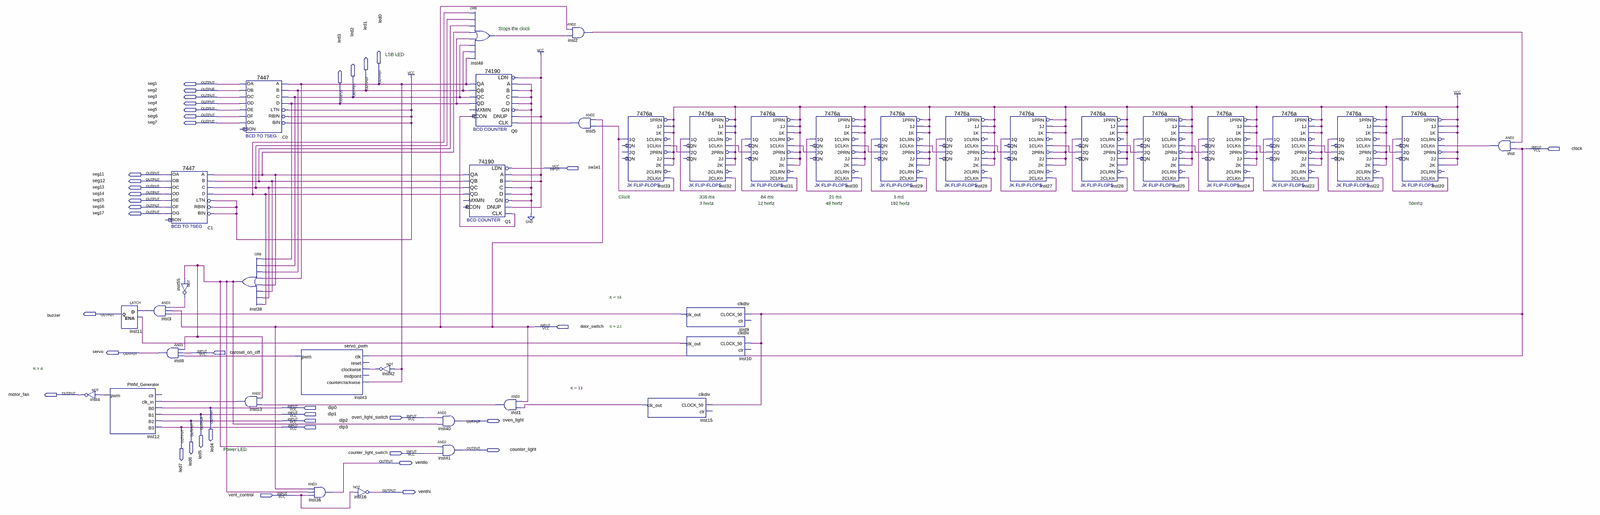
[diagram p0: schematic sheet, whole]
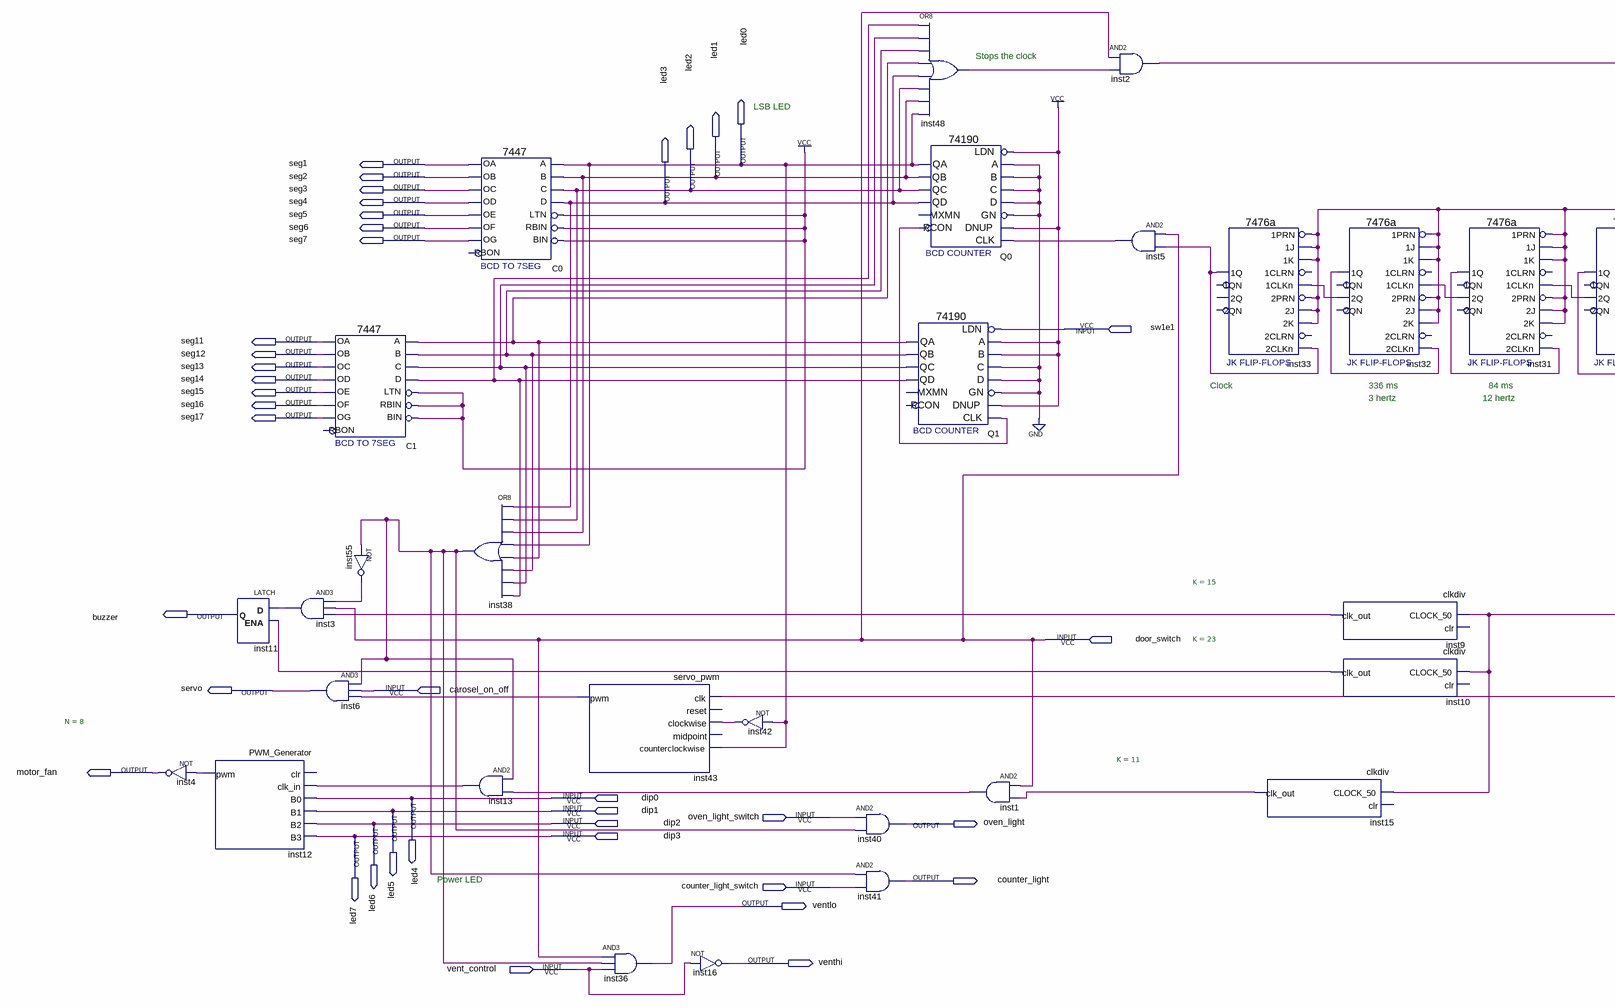
[diagram p1: schematic sheet, left part]
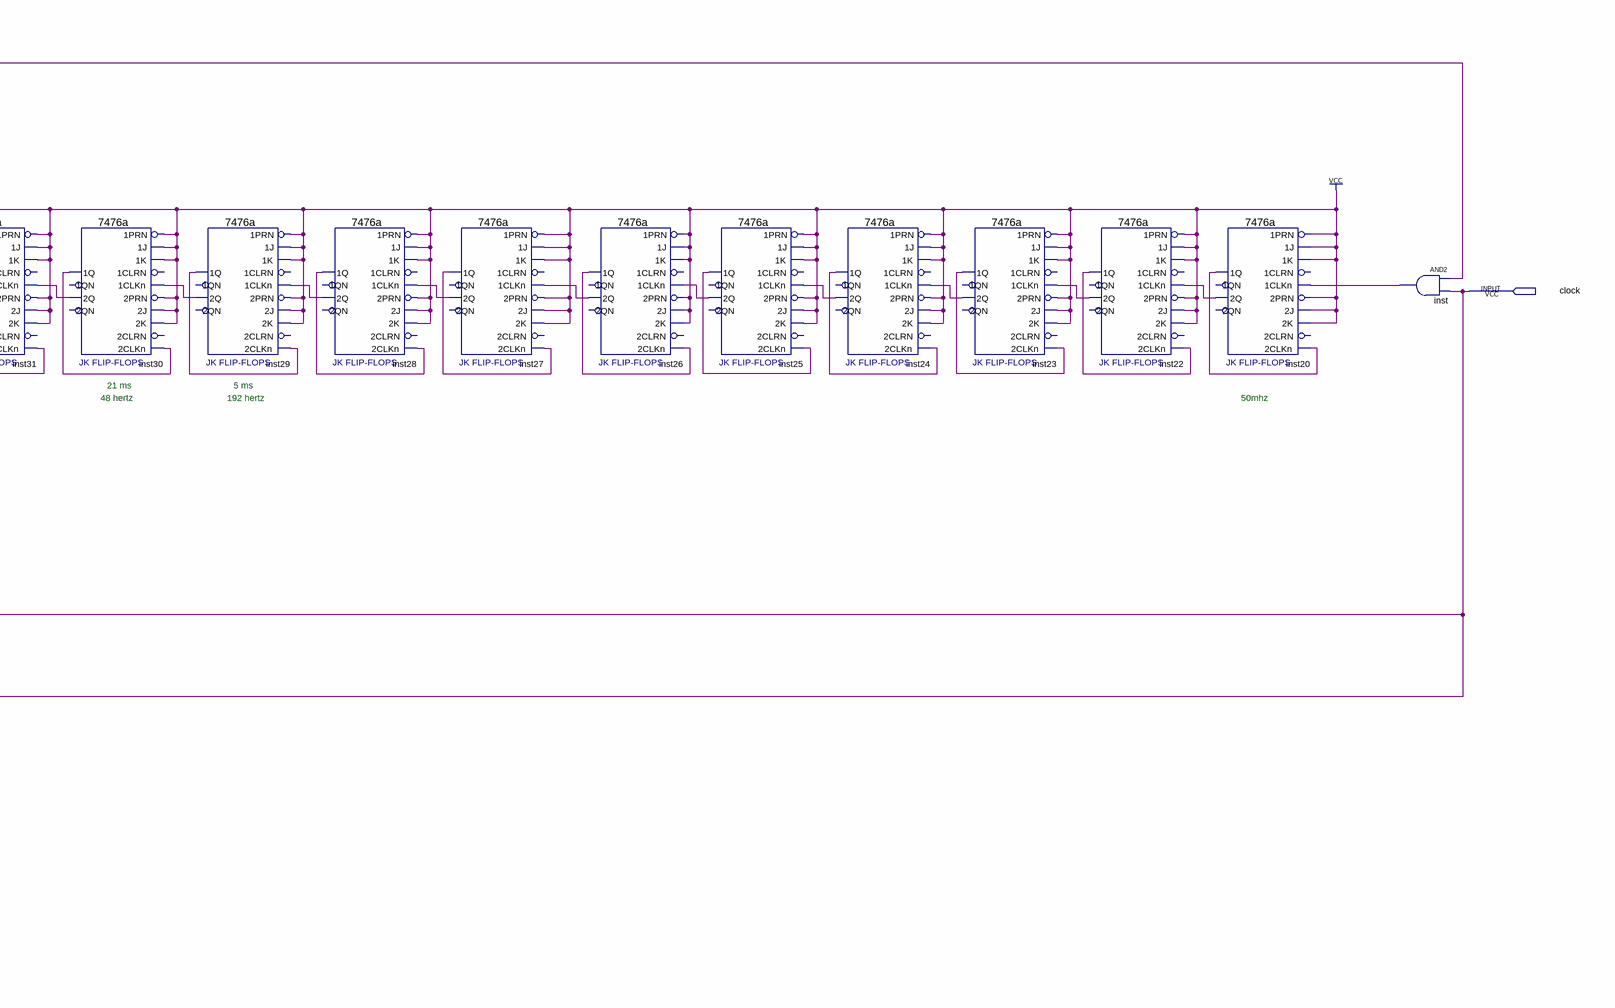
[diagram p2: schematic sheet, right part]
// Quartus schematic lidl.bdf as structural Verilog: 39 symbols, 40 pins
module lidl (
  input  clock,
  input  sw1e1,
  input  door_switch,
  input  carosel_on_off,
  input  dip0,
  input  dip1,
  input  oven_light_switch,
  input  dip2,
  input  dip3,
  input  counter_light_switch,
  input  vent_control,
  output seg1,
  output led0,
  output seg2,
  output led1,
  output seg3,
  output led2,
  output seg4,
  output led3,
  output seg5,
  output seg6,
  output seg7,
  output seg11,
  output seg12,
  output seg13,
  output seg14,
  output seg15,
  output seg16,
  output seg17,
  output buzzer,
  output servo,
  output motor_fan,
  output led4,
  output led5,
  output led6,
  output oven_light,
  output led7,
  output counter_light,
  output ventlo,
  output venthi
);

  wire inst1_out, inst2_out, inst3_out, inst5_out, inst9_clk_out, inst10_clk_out, inst12_pwm, inst13_out,
       inst15_clk_out, inst20_1q, inst20_2q, inst22_1q, inst22_2q, inst23_1q, inst23_2q, inst24_1q,
       inst24_2q, inst25_1q, inst25_2q, inst26_1q, inst26_2q, inst27_1q, inst27_2q, inst28_1q, inst28_2q,
       inst29_1q, inst29_2q, inst30_1q, inst30_2q, inst31_1q, inst31_2q, inst32_1q, inst32_2q, inst33_1q,
       inst38_out, inst42_out, inst43_pwm, inst48_out, inst55_out, inst_out, Q0_rcon, Q1_qa, Q1_qb, Q1_qc,
       Q1_qd;

  not inst4 (motor_fan, inst12_pwm);
  PWM_Generator #(.N(8)) inst12 (
    .clk_in(inst13_out), .B0(dip0), .B1(dip1), .B2(dip2), .B3(dip3), .pwm(inst12_pwm));  // open: clr
  LATCH inst11 (.D(inst3_out), .ENA(inst10_clk_out), .Q(buzzer));
  and inst3 (inst3_out, inst55_out, door_switch, inst9_clk_out);
  and inst6 (servo, inst38_out, carosel_on_off, inst43_pwm);
  \7447  C1 (
    .LTN(1'b1), .B(Q1_qb), .C(Q1_qc), .D(Q1_qd), .RBIN(1'b1), .BIN(1'b1), .A(Q1_qa), .OB(seg12), .OC(seg13),
    .OE(seg15), .OD(seg14), .OF(seg16), .OG(seg17), .OA(seg11));  // open: RBON
  not inst55 (inst55_out, inst38_out);
  \7447  C0 (
    .LTN(1'b1), .B(led1), .C(led2), .D(led3), .RBIN(1'b1), .BIN(1'b1), .A(led0), .OB(seg2), .OC(seg3),
    .OE(seg5), .OD(seg4), .OF(seg6), .OG(seg7), .OA(seg1));  // open: RBON
  or inst38 (inst38_out, led3, led2, led1, led0, Q1_qa, Q1_qb, Q1_qc, Q1_qd);
  and inst13 (inst13_out, inst38_out, inst1_out);
  servo_pwm inst43 (
    .clk(clock), .clockwise(inst42_out), .counterclockwise(led0), .pwm(inst43_pwm));  // open: reset, midpoint
  and inst36 (ventlo, door_switch, inst38_out, vent_control);
  not inst16 (venthi, vent_control);
  not inst42 (inst42_out, led0);
  and inst40 (oven_light, oven_light_switch, inst38_out);
  and inst41 (counter_light, inst38_out, counter_light_switch);
  or inst48 (inst48_out, Q1_qd, Q1_qc, Q1_qb, Q1_qa, led3, led2, led1, led0);
  \74190  Q0 (
    .LDN(1'b1), .A(1'b0), .C(1'b0), .B(1'b0), .D(1'b0), .GN(1'b0), .CLK(inst5_out), .DNUP(1'b1), .QA(led0),
    .QB(led1), .QD(led3), .QC(led2), .RCON(Q0_rcon));  // open: MXMN
  \74190  Q1 (
    .LDN(sw1e1), .A(1'b1), .C(1'b0), .B(1'b1), .D(1'b0), .GN(1'b0), .CLK(Q0_rcon), .DNUP(1'b1), .QA(Q1_qa),
    .QB(Q1_qb), .QD(Q1_qd), .QC(Q1_qc));  // open: MXMN, RCON
  and inst1 (inst1_out, door_switch, inst15_clk_out);
  and inst2 (inst2_out, door_switch, inst48_out);
  and inst5 (inst5_out, door_switch, inst33_1q);
  \7476a  inst33 (
    .\2CLKn (inst33_1q), .\1PRN (1'b1), .\1K (1'b1), .\1J (1'b1), .\1CLKn (inst32_2q), .\2K (1'b1),
    .\2J (1'b1), .\2PRN (1'b1), .\1Q (inst33_1q));  // open: 2CLRN, 1CLRN, 2QN, 2Q, 1QN
  clkdiv #(.K(11)) inst15 (.CLOCK_50(clock), .clk_out(inst15_clk_out));  // open: clr
  clkdiv #(.K(15)) inst9 (.CLOCK_50(clock), .clk_out(inst9_clk_out));  // open: clr
  clkdiv #(.K(23)) inst10 (.CLOCK_50(clock), .clk_out(inst10_clk_out));  // open: clr
  \7476a  inst32 (
    .\2CLKn (inst32_1q), .\1PRN (1'b1), .\1K (1'b1), .\1J (1'b1), .\1CLKn (inst31_2q), .\2K (1'b1),
    .\2J (1'b1), .\2PRN (1'b1), .\2Q (inst32_2q), .\1Q (inst32_1q));  // open: 2CLRN, 1CLRN, 2QN, 1QN
  \7476a  inst31 (
    .\2CLKn (inst31_1q), .\1PRN (1'b1), .\1K (1'b1), .\1J (1'b1), .\1CLKn (inst30_2q), .\2K (1'b1),
    .\2J (1'b1), .\2PRN (1'b1), .\2Q (inst31_2q), .\1Q (inst31_1q));  // open: 2CLRN, 1CLRN, 2QN, 1QN
  \7476a  inst30 (
    .\2CLKn (inst30_1q), .\1PRN (1'b1), .\1K (1'b1), .\1J (1'b1), .\1CLKn (inst29_2q), .\2K (1'b1),
    .\2J (1'b1), .\2PRN (1'b1), .\2Q (inst30_2q), .\1Q (inst30_1q));  // open: 2CLRN, 1CLRN, 2QN, 1QN
  \7476a  inst29 (
    .\2CLKn (inst29_1q), .\1PRN (1'b1), .\1K (1'b1), .\1J (1'b1), .\1CLKn (inst28_2q), .\2K (1'b1),
    .\2J (1'b1), .\2PRN (1'b1), .\2Q (inst29_2q), .\1Q (inst29_1q));  // open: 2CLRN, 1CLRN, 2QN, 1QN
  \7476a  inst28 (
    .\2CLKn (inst28_1q), .\1PRN (1'b1), .\1K (1'b1), .\1J (1'b1), .\1CLKn (inst27_2q), .\2K (1'b1),
    .\2J (1'b1), .\2PRN (1'b1), .\2Q (inst28_2q), .\1Q (inst28_1q));  // open: 2CLRN, 1CLRN, 2QN, 1QN
  \7476a  inst27 (
    .\2CLKn (inst27_1q), .\1PRN (1'b1), .\1K (1'b1), .\1J (1'b1), .\1CLKn (inst26_2q), .\2K (1'b1),
    .\2J (1'b1), .\2PRN (1'b1), .\2Q (inst27_2q), .\1Q (inst27_1q));  // open: 2CLRN, 1CLRN, 2QN, 1QN
  \7476a  inst26 (
    .\2CLKn (inst26_1q), .\1PRN (1'b1), .\1K (1'b1), .\1J (1'b1), .\1CLKn (inst25_2q), .\2K (1'b1),
    .\2J (1'b1), .\2PRN (1'b1), .\2Q (inst26_2q), .\1Q (inst26_1q));  // open: 2CLRN, 1CLRN, 2QN, 1QN
  \7476a  inst25 (
    .\2CLKn (inst25_1q), .\1PRN (1'b1), .\1K (1'b1), .\1J (1'b1), .\1CLKn (inst24_2q), .\2K (1'b1),
    .\2J (1'b1), .\2PRN (1'b1), .\2Q (inst25_2q), .\1Q (inst25_1q));  // open: 2CLRN, 1CLRN, 2QN, 1QN
  \7476a  inst24 (
    .\2CLKn (inst24_1q), .\1PRN (1'b1), .\1K (1'b1), .\1J (1'b1), .\1CLKn (inst23_2q), .\2K (1'b1),
    .\2J (1'b1), .\2PRN (1'b1), .\2Q (inst24_2q), .\1Q (inst24_1q));  // open: 2CLRN, 1CLRN, 2QN, 1QN
  \7476a  inst23 (
    .\2CLKn (inst23_1q), .\1PRN (1'b1), .\1K (1'b1), .\1J (1'b1), .\1CLKn (inst22_2q), .\2K (1'b1),
    .\2J (1'b1), .\2PRN (1'b1), .\2Q (inst23_2q), .\1Q (inst23_1q));  // open: 2CLRN, 1CLRN, 2QN, 1QN
  \7476a  inst22 (
    .\2CLKn (inst22_1q), .\1PRN (1'b1), .\1K (1'b1), .\1J (1'b1), .\1CLKn (inst20_2q), .\2K (1'b1),
    .\2J (1'b1), .\2PRN (1'b1), .\2Q (inst22_2q), .\1Q (inst22_1q));  // open: 2CLRN, 1CLRN, 2QN, 1QN
  \7476a  inst20 (
    .\2CLKn (inst20_1q), .\1PRN (1'b1), .\1K (1'b1), .\1J (1'b1), .\1CLKn (inst_out), .\2K (1'b1),
    .\2J (1'b1), .\2PRN (1'b1), .\2Q (inst20_2q), .\1Q (inst20_1q));  // open: 2CLRN, 1CLRN, 2QN, 1QN
  and inst (inst_out, inst2_out, clock);

  assign led4 = dip0;
  assign led5 = dip1;
  assign led6 = dip2;
  assign led7 = dip3;

  // Notes on the sheet:
  //   Stops the clock
  //   LSB LED
  //   Clock
  //   336 ms
  //   84 ms
  //   21 ms
  //   5 ms
  //   3 hertz
  //   12 hertz
  //   48 hertz
  //   192 hertz
  //   50mhz
  //   Power LED
endmodule
